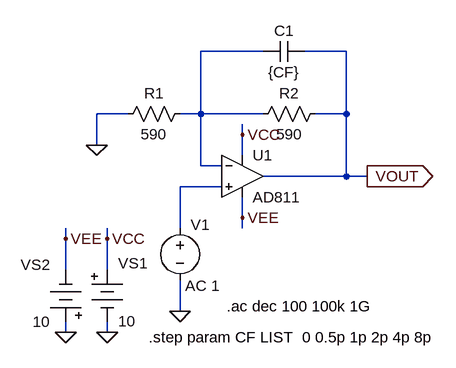
[diagram p0: schematic fig-02-05-09.asc]
fig-02-05-09.asc, the LTspice schematic file:
Version 4
SHEET 1 1332 680
WIRE 288 -32 192 -32
WIRE 416 -32 352 -32
WIRE 80 64 32 64
WIRE 192 64 192 -32
WIRE 192 64 160 64
WIRE 288 64 192 64
WIRE 416 64 416 -32
WIRE 416 64 368 64
WIRE 256 96 256 80
WIRE 32 112 32 64
WIRE 256 128 256 96
WIRE 192 144 192 64
WIRE 224 144 192 144
WIRE 416 160 416 64
WIRE 416 160 288 160
WIRE 448 160 416 160
WIRE 224 176 160 176
WIRE 256 224 256 192
WIRE 160 240 160 176
WIRE 256 240 256 224
WIRE -16 256 -16 240
WIRE 48 256 48 240
WIRE -16 304 -16 256
WIRE 48 304 48 256
WIRE 160 368 160 320
WIRE -16 400 -16 384
WIRE 48 400 48 384
FLAG 160 368 0
FLAG 448 160 VOUT
IOPIN 448 160 Out
FLAG 32 112 0
FLAG -16 400 0
FLAG 48 400 0
FLAG -16 256 VEE
FLAG 48 256 VCC
FLAG 256 96 VCC
FLAG 256 224 VEE
SYMBOL res 384 48 R90
WINDOW 0 0 56 VBottom 2
WINDOW 3 32 56 VTop 2
SYMATTR InstName R2
SYMATTR Value 590
SYMBOL res 176 48 R90
WINDOW 0 0 56 VBottom 2
WINDOW 3 32 56 VTop 2
SYMATTR InstName R1
SYMATTR Value 590
SYMBOL voltage 160 224 R0
WINDOW 0 31 26 Bottom 2
WINDOW 3 242 38 Top 2
WINDOW 123 35 89 Top 2
WINDOW 39 0 0 Left 0
SYMATTR InstName V1
SYMATTR Value ""
SYMATTR Value2 AC 1
SYMBOL Misc\\battery 48 288 R0
WINDOW 0 17 6 Left 2
WINDOW 3 17 95 Left 2
WINDOW 123 0 0 Left 0
WINDOW 39 0 0 Left 0
SYMATTR InstName VS1
SYMATTR Value 10
SYMBOL Misc\\battery -16 400 R180
WINDOW 0 24 104 Left 2
WINDOW 3 24 16 Left 2
WINDOW 123 0 0 Left 0
WINDOW 39 0 0 Left 0
SYMATTR InstName VS2
SYMATTR Value 10
SYMBOL Opamps\\AD811 256 96 R0
SYMATTR InstName U1
SYMBOL cap 352 -48 R90
WINDOW 0 0 32 VBottom 2
WINDOW 3 32 32 VTop 2
SYMATTR InstName C1
SYMATTR Value {CF}
TEXT 112 408 Left 2 !.step param CF LIST  0 0.5p 1p 2p 4p 8p
TEXT 232 360 Left 2 !.ac dec 100 100k 1G

The netlist it stands for:
* fig-02-05-09.asc
R2 VOUT N001 590
R1 N001 0 590
V1 N002 0 AC 1
VS1 VCC 0 10
VS2 0 VEE 10
XU1 N002 N001 VCC VEE VOUT AD811  ; pins In+ In- V+ V- OUT
C1 VOUT N001 {CF}
.step param CF LIST  0 0.5p 1p 2p 4p 8p
.ac dec 100 100k 1G
.backanno
.end